# EAGLE design DCP2PLS (EAGLE 7.7.0)
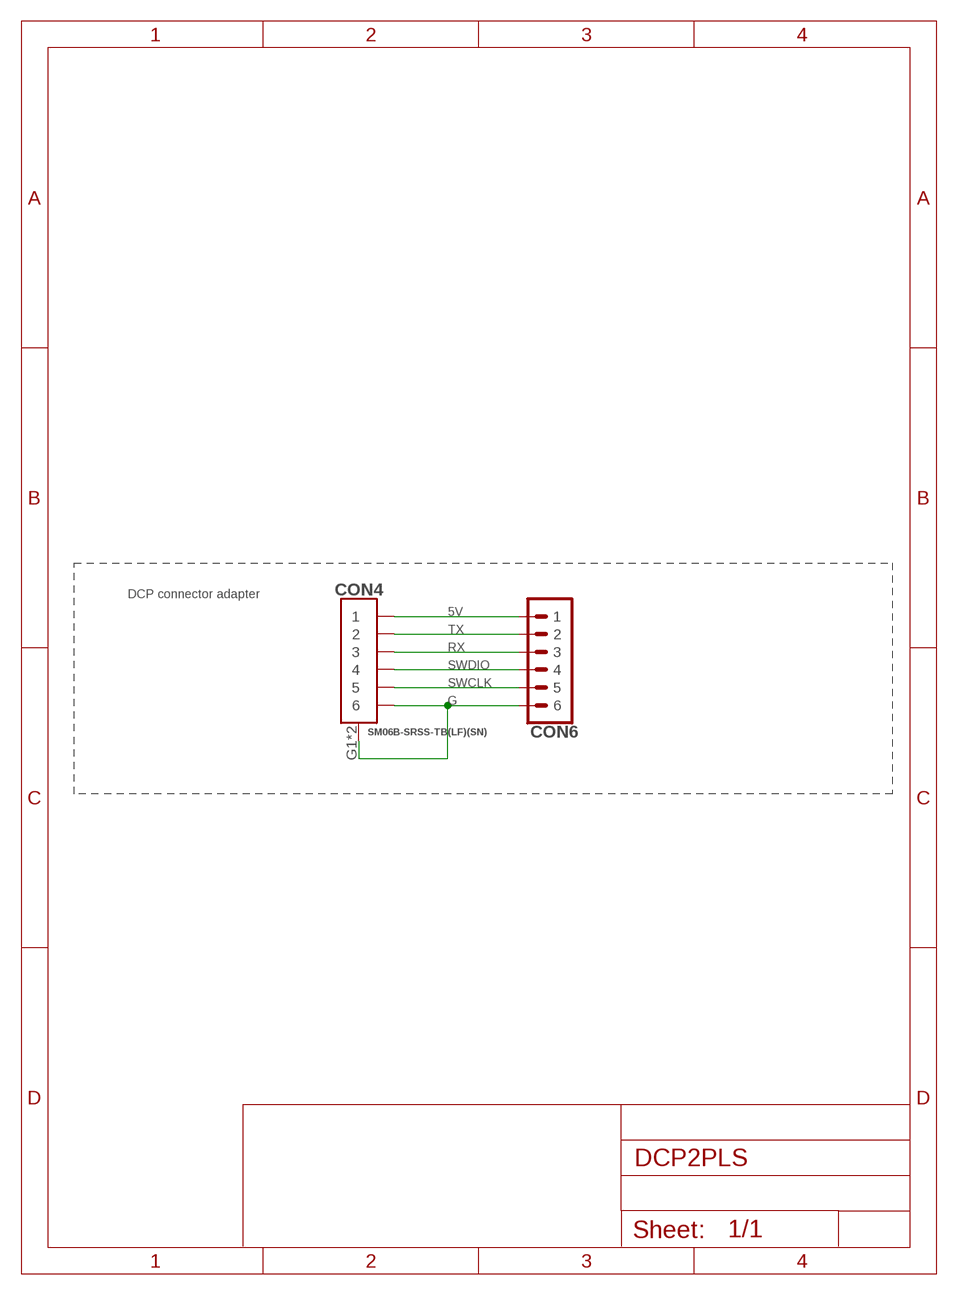
[diagram p0: schematic, sheet 1]

## Parts
CON4  CON-6P  [SM06B]
CON6  PINHEAD_1X06-2.54  [1X06-PTH-2.54]

## Nets
5V: CON4.1 CON6.1
G: CON4.6 CON4.G1 CON4.G2(G1) CON6.6
RX: CON4.3 CON6.3
SWCLK: CON4.5 CON6.5
SWDIO: CON4.4 CON6.4
TX: CON4.2 CON6.2

## Notes on the sheet
- DCP connector adapter

## Library data of the parts
CON4 = Connectors:CON-6P: CONN HEADER SH 6POS SIDE 1MM TIN; DIGIKEY#: 455-1806-1-ND; MANF: JST Sales America Inc; MANF#: SM06B-SRSS-TB(LF)(SN); PITCH: 1mm
CON6 = pinhead:PINHEAD_1X06: pinheader 6P

## Board
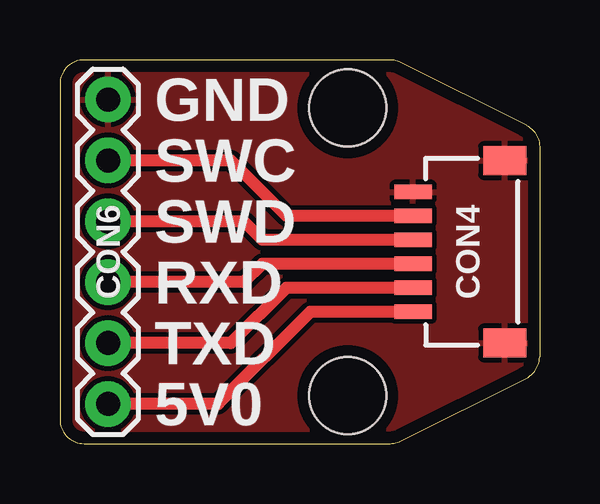
[diagram p1: board, top side]
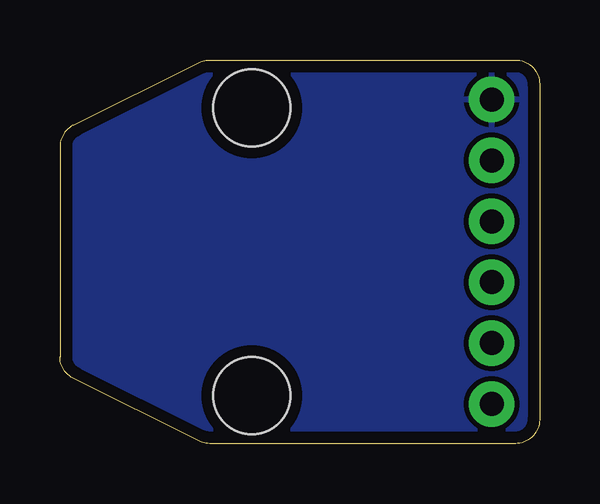
[diagram p2: board, bottom side, seen from below]

Size 20 x 16 mm. Coordinates in mm from the lower left corner, seen from the top.
Outline: 0,15 0,1 arc90 1,0 13.76,0 arc27 14.21,0.11 19.45,2.72 arc63 20,3.62 20,12.38 arc63 19.45,13.28 14.21,15.89 arc27 13.76,16 1,16 arc90 0,15
Copper layers (1*16): Top 0.035mm / dielectric 0.5mm / Bottom 0.035mm
Design rules "usb2can_drc *": minimum track width 0.2mm, minimum drill 0.2mm, track to track 0.2mm, track to pad 0.2mm, pad to pad 0.2mm, via to via 0.2mm, smd to smd 0.15mm, copper to edge 0.5mm, drill to drill 0.2mm, minimum pad ring 0.125mm, minimum via ring 0.125mm, stop-mask expansion 1mil, vias tented up to drill 0.51mm, thermal gap 8mil
Holes 3.2 mm at 12,14 12,2

### Footprints (pad centres in the part's own frame; a part is rotated, then mirrored left to right if it is on the bottom)
SM06B = smd 0.6 x 1.55: 1 -2.5,2.275; 2 -1.5,2.275; 3 -0.5,2.275; 4 0.5,2.275; 5 1.5,2.275; 6 2.5,2.275 | smd 1.2 x 1.8: G1 -3.8,-1.55; G2 3.8,-1.55
1X06-PTH-2.54 = drill 1 pad 1.9: 1 -6.35,0; 2 -3.81,0; 3 -1.27,0; 4 1.27,0; 5 3.81,0; 6 6.35,0

### Placement (x,y rotation side)
CON4  17,8 90 top
CON6  2,8 90 top

### Tracks (layer width: path | path; a pad name or v marks a point on that pad's centre or on a via)
5V
  Top 0.5: CON4.1 10.45,5.5 6.6,1.65 CON6.1
G
  pour Top: 0,1 0,15 arc-90 1,16 19,16 arc-90 20,15 20,1 arc-90 19,0 1,0 arc-90
  pour Bottom: 0,1 0,15 arc-90 1,16 19,16 arc-90 20,15 20,1 arc-90 19,0 1,0 arc-90
RX
  Top 0.5: CON4.3 8.45,7.5 7.67,6.73 CON6.3
SWCLK
  Top 0.5: CON4.5 9.45,9.5 7.13,11.81 CON6.5
SWDIO
  Top 0.5: CON4.4 8.45,8.5 7.67,9.27 CON6.4
TX
  Top 0.5: CON4.2 9.45,6.5 7.13,4.19 CON6.2

### Text on the board
tPlace: GND | SWC | SWD | RXD | TXD | 5V0